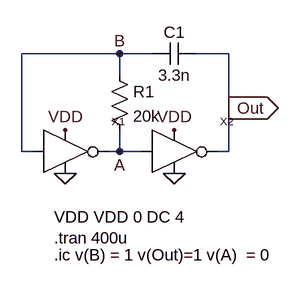
[diagram p0: schematic RC Oscilator.asc]
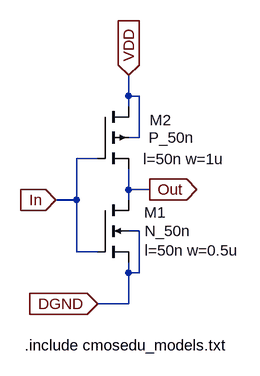
[diagram p1: sub-circuit inverter.asc]
RC Oscilator.asc, the LTspice schematic file:
Version 4
SHEET 1 880 680
WIRE 160 48 16 48
WIRE 208 48 160 48
WIRE 320 48 272 48
WIRE 160 80 160 48
WIRE 320 128 320 48
WIRE 16 192 16 48
WIRE 32 192 16 192
WIRE 160 192 160 160
WIRE 160 192 144 192
WIRE 192 192 160 192
WIRE 320 192 320 128
WIRE 320 192 304 192
FLAG 80 224 0
FLAG 240 224 0
FLAG 80 160 VDD
FLAG 240 160 VDD
FLAG 320 128 Out
IOPIN 320 128 Out
FLAG 160 192 A
FLAG 160 48 B
SYMBOL Inverter 48 192 R0
SYMATTR InstName X1
SYMBOL Inverter 208 192 R0
SYMATTR InstName X2
SYMBOL res 144 64 R0
SYMATTR InstName R1
SYMATTR Value 20k
SYMBOL cap 272 32 R90
WINDOW 0 0 32 VBottom 2
WINDOW 3 32 32 VTop 2
SYMATTR InstName C1
SYMATTR Value 3.3n
TEXT 64 288 Left 2 !VDD VDD 0 DC 4\n.tran 400u
TEXT 64 344 Left 2 !.ic v(B) = 1 v(Out)=1 v(A)  = 0

inverter.asc, the sub-circuit schematic file:
Version 4
SHEET 1 880 680
WIRE 176 16 176 -16
WIRE 192 16 176 16
WIRE 176 32 176 16
WIRE 192 80 192 16
WIRE 192 80 176 80
WIRE 128 112 96 112
WIRE 176 160 176 128
WIRE 208 160 176 160
WIRE 96 176 96 112
WIRE 96 176 64 176
WIRE 176 176 176 160
WIRE 192 224 176 224
WIRE 96 256 96 176
WIRE 128 256 96 256
WIRE 176 288 176 272
WIRE 192 288 192 224
WIRE 192 288 176 288
WIRE 176 336 176 288
WIRE 176 336 128 336
FLAG 176 -16 VDD
IOPIN 176 -16 In
FLAG 64 176 In
IOPIN 64 176 In
FLAG 208 160 Out
IOPIN 208 160 Out
FLAG 128 336 DGND
IOPIN 128 336 In
SYMBOL nmos4 128 176 R0
WINDOW 0 72 19 Left 0
WINDOW 3 73 48 Left 0
WINDOW 123 73 78 Left 0
SYMATTR InstName M1
SYMATTR Value N_50n
SYMATTR Value2 l=50n w=0.5u
SYMBOL pmos4 128 32 R0
WINDOW 0 80 21 Left 0
WINDOW 3 79 48 Left 0
WINDOW 123 70 81 Left 0
SYMATTR InstName M2
SYMATTR Value P_50n
SYMATTR Value2 l=50n w=1u
TEXT 16 400 Left 0 !.include cmosedu_models.txt

The netlist it stands for:
* RC Oscilator.asc
XX1 B A VDD 0 inverter
XX2 A Out VDD 0 inverter
R1 B A 20k
C1 Out B 3.3n

* block symbol definitions
.subckt inverter In Out VDD DGND
M1 Out In DGND DGND N_50n l=50n w=0.5u
M2 VDD In Out VDD P_50n l=50n w=1u
.include cmosedu_models.txt
.ends inverter

.model NMOS NMOS
.model PMOS PMOS
.lib standard.mos
VDD VDD 0 DC 4
.tran 400u
.ic v(B) = 1 v(Out)=1 v(A)  = 0
.backanno
.end